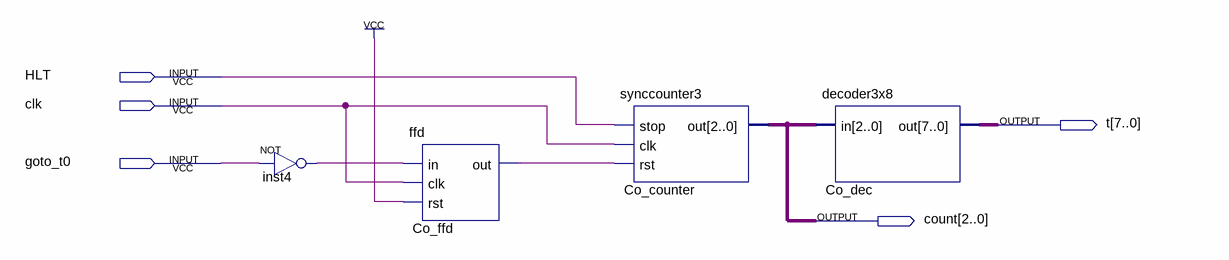
[diagram p0: schematic sheet]
// Quartus schematic timer.bdf as structural Verilog: 4 symbols, 5 pins
module timer (
  input  HLT,
  input  clk,
  input  goto_t0,
  output [7:0] t,
  output [2:0] count
);

  wire Co_ffd_out, inst4_out;

  not inst4 (inst4_out, goto_t0);
  ffd Co_ffd (.in(inst4_out), .clk(clk), .rst(1'b1), .out(Co_ffd_out));
  synccounter3 Co_counter (.stop(HLT), .clk(clk), .rst(Co_ffd_out), .out(count));
  decoder3x8 Co_dec (.in(count), .out(t));
endmodule
